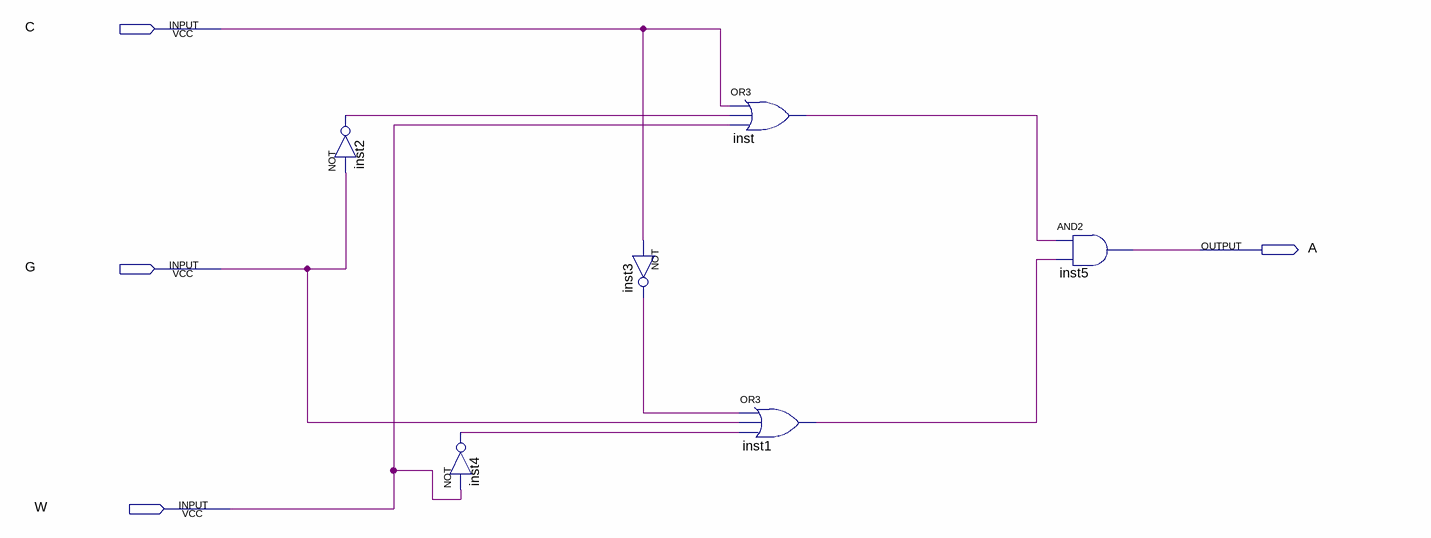
[diagram p0: schematic sheet]
// Quartus schematic lab3step0.bdf as structural Verilog: 6 symbols, 4 pins
module lab3step0 (
  input  C,
  input  G,
  input  W,
  output A
);

  wire inst1_out, inst2_out, inst3_out, inst4_out, inst_out;

  not inst2 (inst2_out, G);
  not inst4 (inst4_out, W);
  not inst3 (inst3_out, C);
  or inst (inst_out, C, inst2_out, W);
  or inst1 (inst1_out, inst3_out, G, inst4_out);
  and inst5 (A, inst_out, inst1_out);
endmodule
